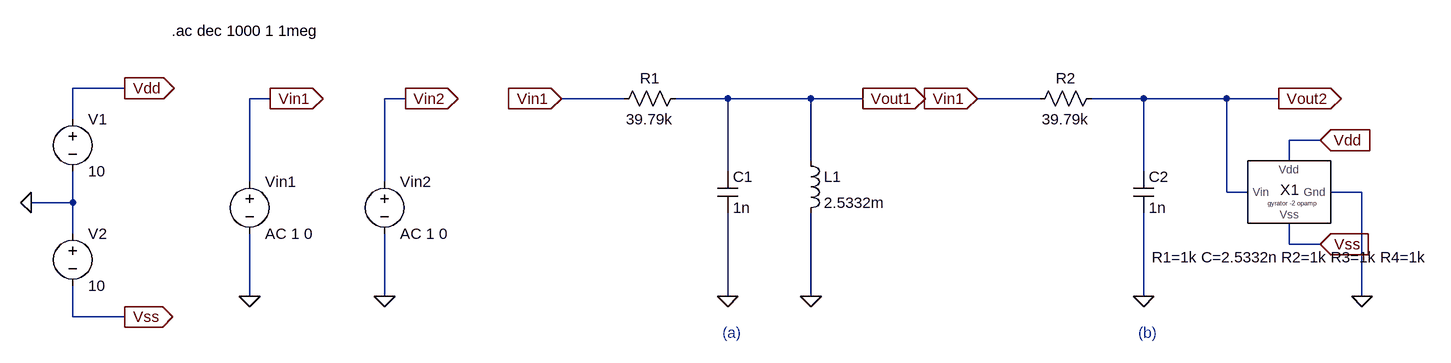
[diagram p0: schematic band pass filter.asc]
band pass filter.asc, the LTspice schematic file:
Version 4
SHEET 1 1700 680
WIRE -272 -160 -352 -160
WIRE -48 -144 -80 -144
WIRE 160 -144 128 -144
WIRE 496 -144 400 -144
WIRE 656 -144 576 -144
WIRE 784 -144 656 -144
WIRE 864 -144 784 -144
WIRE 1136 -144 1040 -144
WIRE 1296 -144 1216 -144
WIRE 1424 -144 1296 -144
WIRE 1504 -144 1424 -144
WIRE -352 -112 -352 -160
WIRE 1568 -80 1520 -80
WIRE 784 -48 784 -144
WIRE 1520 -48 1520 -80
WIRE 656 -32 656 -144
WIRE 1296 -32 1296 -144
WIRE -80 -16 -80 -144
WIRE 128 -16 128 -144
WIRE 1424 0 1424 -144
WIRE 1456 0 1424 0
WIRE 1632 0 1584 0
WIRE -352 16 -352 -32
WIRE -352 16 -416 16
WIRE -352 64 -352 16
WIRE 1520 80 1520 48
WIRE 1568 80 1520 80
WIRE -80 160 -80 64
WIRE 128 160 128 64
WIRE 656 160 656 32
WIRE 784 160 784 32
WIRE 1296 160 1296 32
WIRE 1632 160 1632 0
WIRE -352 192 -352 144
WIRE -272 192 -352 192
FLAG -80 160 0
FLAG -48 -144 Vin1
IOPIN -48 -144 Out
FLAG -416 16 0
FLAG -272 -160 Vdd
IOPIN -272 -160 Out
FLAG -272 192 Vss
IOPIN -272 192 Out
FLAG 128 160 0
FLAG 160 -144 Vin2
IOPIN 160 -144 Out
FLAG 656 160 0
FLAG 784 160 0
FLAG 400 -144 Vin1
IOPIN 400 -144 In
FLAG 1296 160 0
FLAG 1632 160 0
FLAG 1040 -144 Vin1
IOPIN 1040 -144 In
FLAG 864 -144 Vout1
IOPIN 864 -144 Out
FLAG 1504 -144 Vout2
IOPIN 1504 -144 Out
FLAG 1568 -80 Vdd
IOPIN 1568 -80 In
FLAG 1568 80 Vss
IOPIN 1568 80 In
SYMBOL voltage -80 -32 R0
WINDOW 123 0 0 Left 0
WINDOW 39 0 0 Left 0
SYMATTR InstName Vin1
SYMATTR Value AC 1 0
SYMBOL voltage -352 -128 R0
WINDOW 123 0 0 Left 0
WINDOW 39 0 0 Left 0
SYMATTR InstName V1
SYMATTR Value 10
SYMBOL voltage -352 48 R0
WINDOW 123 0 0 Left 0
WINDOW 39 0 0 Left 0
SYMATTR InstName V2
SYMATTR Value 10
SYMBOL voltage 128 -32 R0
WINDOW 123 0 0 Left 0
WINDOW 39 0 0 Left 0
SYMATTR InstName Vin2
SYMATTR Value AC 1 0
SYMBOL res 592 -160 R90
WINDOW 0 0 56 VBottom 2
WINDOW 3 32 56 VTop 2
SYMATTR InstName R1
SYMATTR Value 39.79k
SYMBOL cap 640 -32 R0
SYMATTR InstName C1
SYMATTR Value 1n
SYMBOL ind 768 -64 R0
SYMATTR InstName L1
SYMATTR Value 2.5332m
SYMBOL res 1232 -160 R90
WINDOW 0 0 56 VBottom 2
WINDOW 3 32 56 VTop 2
SYMATTR InstName R2
SYMATTR Value 39.79k
SYMBOL cap 1280 -32 R0
SYMATTR InstName C2
SYMATTR Value 1n
SYMBOL Gyr2 1520 -16 R0
WINDOW 0 1 28 Bottom 2
WINDOW 39 3 132 Bottom 2
SYMATTR InstName X1
SYMATTR SpiceLine R1=1k C=2.5332n R2=1k R3=1k R4=1k
TEXT -200 -248 Left 2 !.ac dec 1000 1 1meg
TEXT 648 216 Left 2 ;(a)
TEXT 1288 216 Left 2 ;(b)

The netlist it stands for:
* band pass filter.asc
Vin1 Vin1 0 AC 1 0
V1 Vdd 0 10
V2 0 Vss 10
Vin2 Vin2 0 AC 1 0
R1 Vout1 Vin1 39.79k
C1 Vout1 0 1n
L1 Vout1 0 2.5332m
R2 Vout2 Vin1 39.79k
C2 Vout2 0 1n
XX1 0 Vdd Vss Vout2 Gyr2 R1=1k C=2.5332n R2=1k R3=1k R4=1k  ; pins Gnd Vdd Vss Vin
.ac dec 1000 1 1meg
* (a)
* (b)
.backanno
.end